# EAGLE design Esquemático (EAGLE 9.6.2)
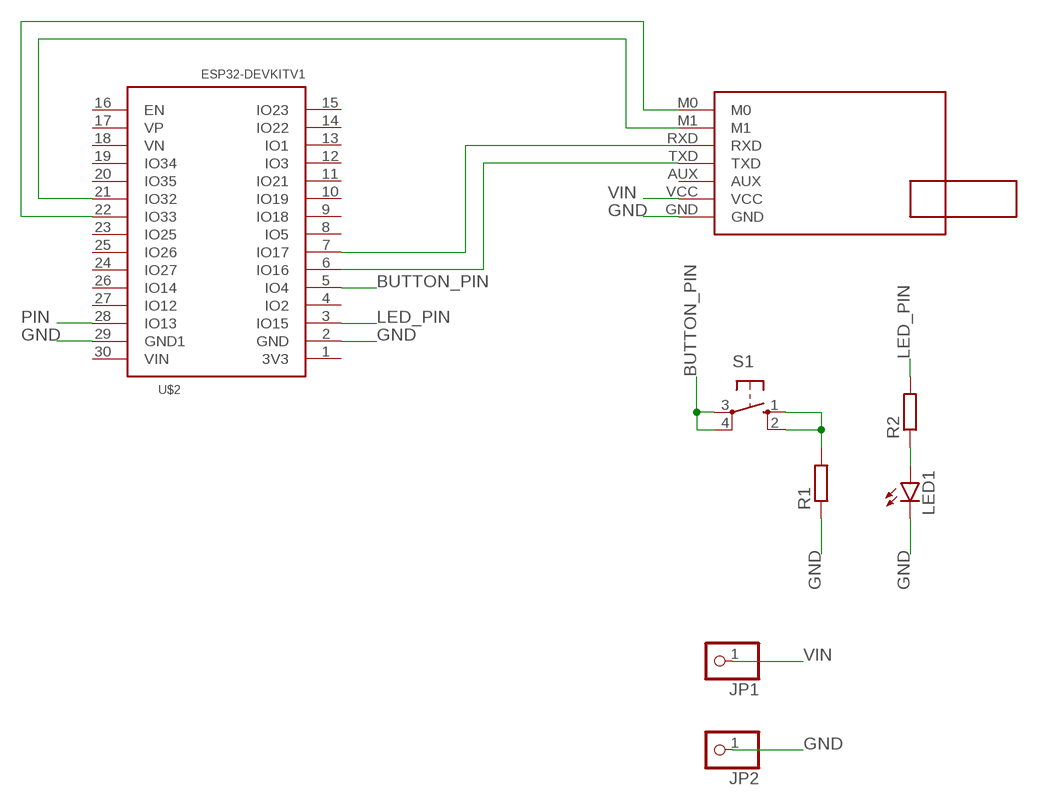
[diagram p0: schematic, sheet 1]

## Parts
JP1  PINHD-1X1  [1X01]
JP2  PINHD-1X1  [1X01]
LED1  LED5MM  [LED5MM]
R1  R-EU_0207/10  [0207/10]
R2  R-EU_0207/10  [0207/10]
S1  10-XX  [B3F-10XX]
U$1  E22-400T30D  [E22-400T30D_FOOTPRINT]
U$2  ESP32DEVKITV1  [ESP32-DEVKITV1]

## Nets
BUTTON_PIN: S1.3(P) S1.4(P1) U$2.5(IO4)
GND: JP2.1 LED1.K(C) R1.1 U$1.GND U$2.2(GND) U$2.29(GND1)
LED_PIN: R2.2 U$2.3(IO15)
N$1: R1.2 S1.1(S) S1.2(S1)
N$2: LED1.A R2.1
N$3: U$1.TXD U$2.6(IO16)
N$4: U$1.RXD U$2.7(IO17)
N$5: U$1.M0 U$2.22(IO33)
N$6: U$1.M1 U$2.21(IO32)
PIN: U$2.28(IO13)
VIN: JP1.1 U$1.VCC
Unconnected: U$1.AUX U$2.1(3V3) U$2.4(IO2) U$2.8(IO5) U$2.9(IO18) U$2.10(IO19) U$2.11(IO21) U$2.12(IO3) U$2.13(IO1) U$2.14(IO22) U$2.15(IO23) U$2.16(EN) U$2.17(VP) U$2.18(VN) U$2.19(IO34) U$2.20(IO35) U$2.23(IO25) U$2.24(IO27) U$2.25(IO26) U$2.26(IO14) U$2.27(IO12) U$2.30(VIN)

## Library data of the parts
JP1 JP2 = pinhead:PINHD-1X1: PIN HEADER
LED1 = led:LED: LED OSRAM: - CHIPLED LG R971, LG N971, LY N971, LG Q971, LY Q971, LO R971, LY R971 LH N974, LH R974 LS Q976, LO Q976, LY Q976 LO Q996 - Hyper CHIPLED LW Q18S LB Q993, LB Q99A, LB R99A - SideLED LS A670, LO A670, LY A670, LG A670, LP A670 LB A673, LV A673, LT A673, LW A673 LH A674 LY A675 LS A676, LA A676, LO A676, LY A676, LW A676 LS A679, LY A679, LG A679 - Hyper Micro SIDELED® LS Y876, LA Y876, LO Y876, LY Y876 LT Y87S - SmartLED LW L88C, LW L88S LB L89C, LB L89S, LG L890 LS L89K, LO L89K, LY L89K LS L896, LA L896, LO L896, LY L896 - TOPLED LS T670, LO T670, LY T670, LG T670, LP T670 LSG T670, LSP T670, LSY T670, LOP T670, LYG T670 LG T671, LOG T671, LSG T671 LB T673, LV T673, LT T673, LW T673 LH T674 LS T676, LA T676, LO T676, LY T676, LB T676, LH T676, LSB T676, LW T676 LB T67C, LV T67C, LT T67C, LS T67K, LO T67K, LY T67K, LW E67C LS E67B, LA E67B, LO E67B, LY E67B, LB E67C, LV E67C, LT E67C LW T67C LS T679, LY T679, LG T679 LS T770, LO T770, LY T770, LG T770, LP T770 LB T773, LV T773, LT T773, LW T773 LH T774 LS E675, LA E675, LY E675, LS T675 LS T776, LA T776, LO T776, LY T776, LB T776 LHGB T686 LT T68C, LB T68C - Hyper Mini TOPLED® LB M676 - Mini TOPLED Santana® LG M470 LS M47K, LO M47K, LY M47K Source: http://www.osram.convergy.de LUXEON: - LUMILED® LXK2-PW12-R00, LXK2-PW12-S00, LXK2-PW14-U00, LXK2-PW14-V00 LXK2-PM12-R00, LXK2-PM12-S00, LXK2-PM14-U00 LXK2-PE12-Q00, LXK2-PE12-R00, LXK2-PE12-S00, LXK2-PE14-T00, LXK2-PE14-U00 LXK2-PB12-K00, LXK2-PB12-L00, LXK2-PB12-M00, LXK2-PB14-N00, LXK2-PB14-P00, LXK2-PB14-Q00 LXK2-PR12-L00, LXK2-PR12-M00, LXK2-PR14-Q00, LXK2-PR14-R00 LXK2-PD12-Q00, LXK2-PD12-R00, LXK2-PD12-S00 LXK2-PH12-R00, LXK2-PH12-S00 LXK2-PL12-P00, LXK2-PL12-Q00, LXK2-PL12-R00 Source: www.luxeon.com KINGBRIGHT: KA-3528ASYC Source: www.kingbright.com
R1 R2 = rcl:R-EU_: RESISTOR, European symbol; SPICEPREFIX: R
S1 = switch-omron:10-XX: OMRON SWITCH; MPN: B3F-1000; OC_FARNELL: 176432; OC_NEWARK: 36M3542
U$1 = CRD:E22-400T30D
U$2 = ESP32-DEVKITV1:ESP32DEVKITV1

## Board
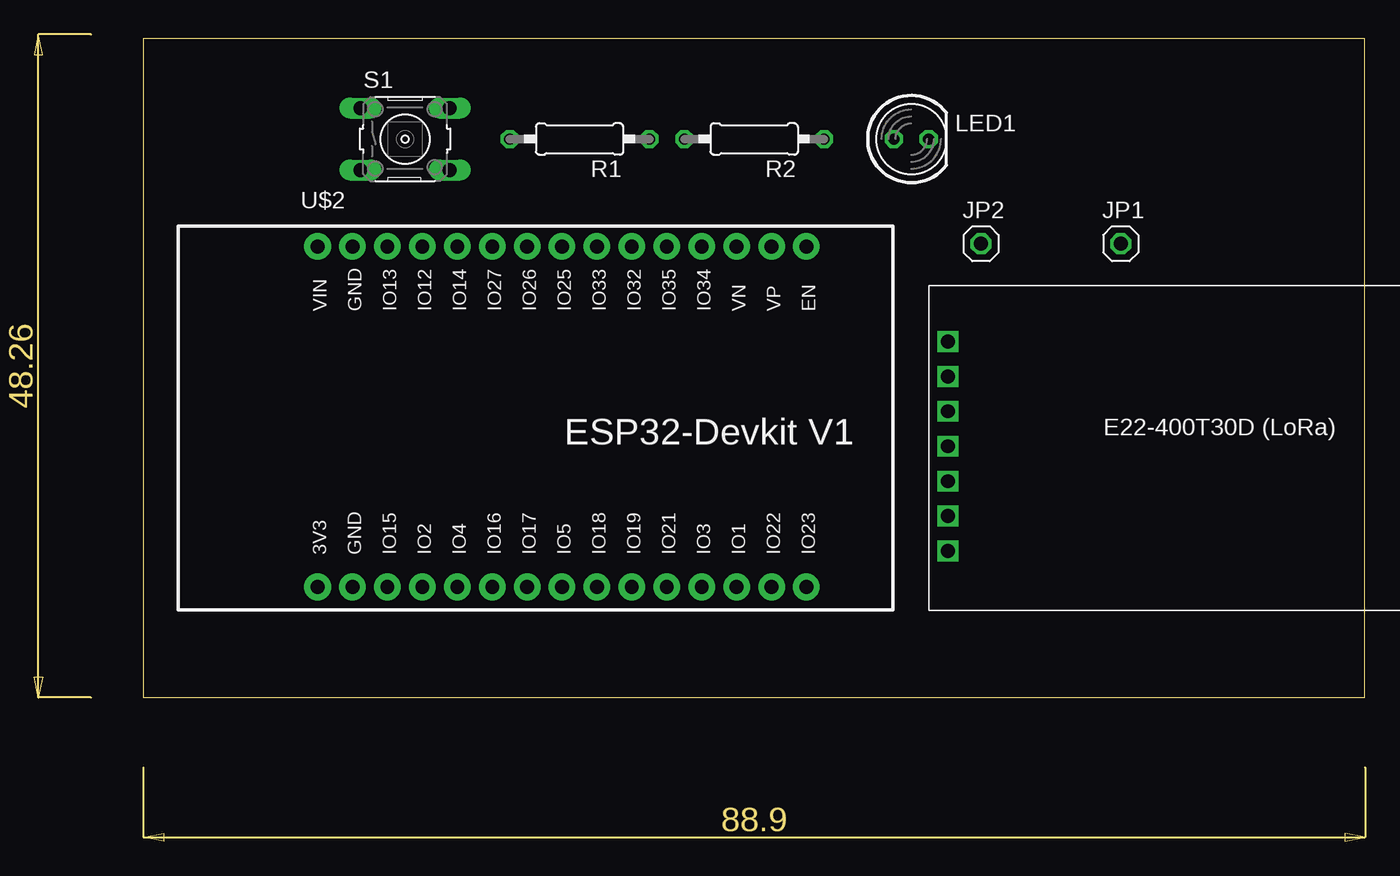
[diagram p1: board, top side]
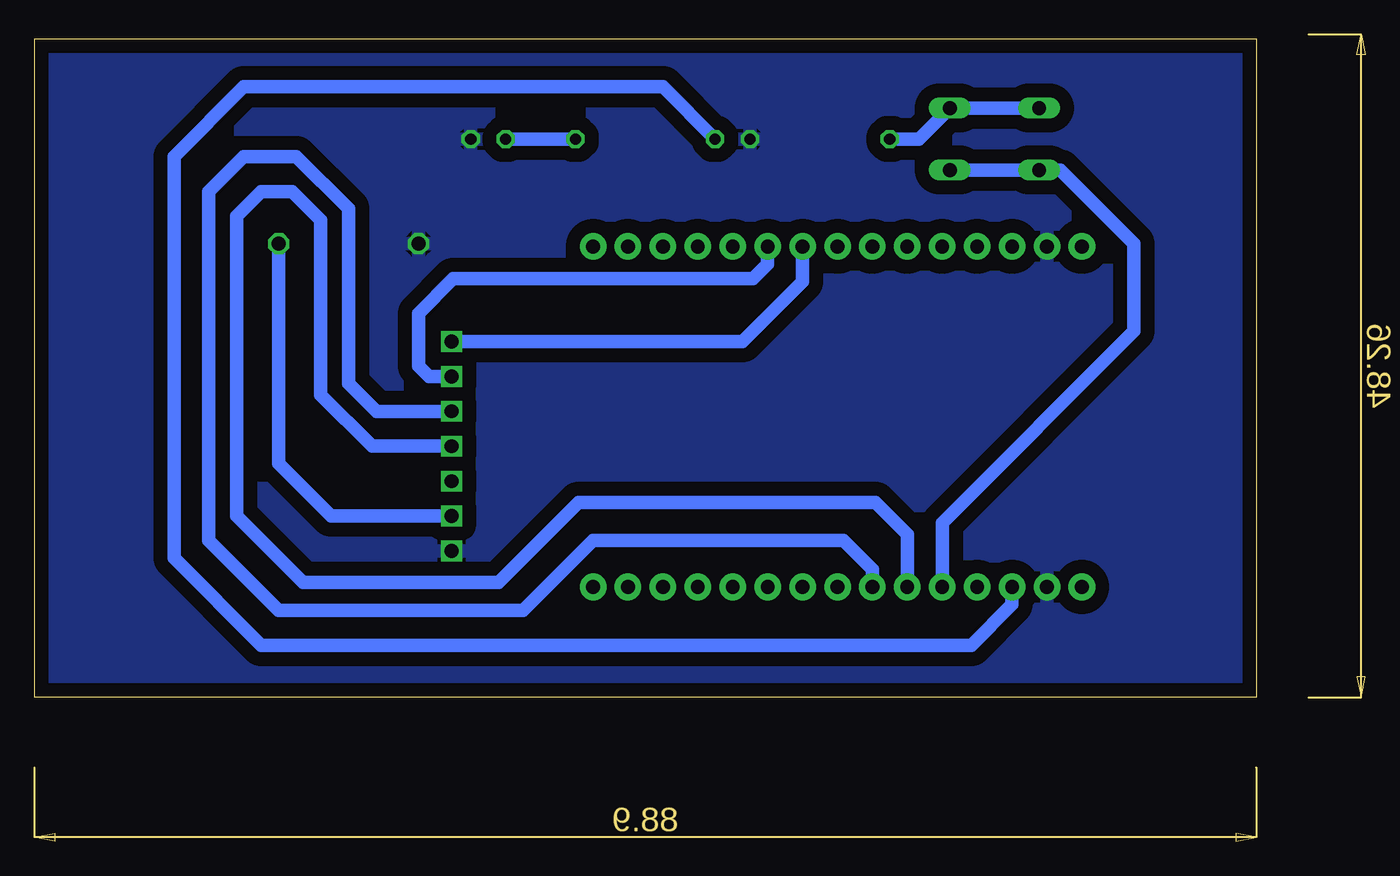
[diagram p2: board, bottom side, seen from below]

Size 88.88 x 47.93 mm. Coordinates in mm from the lower left corner, seen from the top.
Outline: 0,0 88.88,0 88.88,47.93 0,47.93 0,0
Copper layers (1*16): Top 0.035mm / dielectric 1.5mm / Bottom 0.035mm
Design rules "default *": minimum track width 1mm, minimum drill 0.35mm, track to track 40mil, track to pad 0.5mm, pad to pad 6mil, via to via 6mil, smd to smd 6mil, copper to edge 40mil, drill to drill 6mil, minimum pad ring 10mil, minimum via ring 8mil, stop-mask expansion 4mil, vias tented up to drill 0mil, thermal gap 10mil

### Footprints (pad centres in the part's own frame; a part is rotated, then mirrored left to right if it is on the bottom)
1X01 = drill 1.016 octagon: 1 0,0
LED5MM = drill 0.813 octagon: A -1.27,0; K 1.27,0
0207/10 = drill 0.813 octagon: 1 -5.08,0; 2 5.08,0
B3F-10XX = drill 1.016 long: 1 -3.251,2.261; 2 3.251,2.261; 3 -3.251,-2.261; 4 3.251,-2.261
E22-400T30D_FOOTPRINT = drill 1 square: AUX -16.383,-0.762; GND -16.383,-5.842; M0 -16.383,9.398; M1 -16.383,6.858; RXD -16.383,4.318; TXD -16.383,1.778; VCC -16.383,-3.302
ESP32-DEVKITV1 = drill 1 pad 1.93: 1 -22.87,-13.54; 2 -20.33,-13.54; 3 -17.79,-13.54; 4 -15.25,-13.54; 5 -12.71,-13.54; 6 -10.17,-13.54; 7 -7.63,-13.54; 8 -5.09,-13.54; 9 -2.55,-13.54; 10 -0.01,-13.54; 11 2.53,-13.54; 12 5.07,-13.54; 13 7.61,-13.54; 14 10.15,-13.54; 15 12.69,-13.54; 16 12.69,11.23; 17 10.15,11.23; 18 7.61,11.23; 19 5.07,11.23; 20 2.53,11.23; 21 -0.01,11.23; 22 -2.55,11.23; 23 -5.09,11.23; 24 -7.63,11.23; 25 -10.17,11.23; 26 -12.71,11.23; 27 -15.25,11.23; 28 -17.79,11.23; 29 -20.33,11.23; 30 -22.87,11.23

### Placement (x,y rotation side)
JP1  71.12,33.02 0 top
JP2  60.96,33.02 0 top
LED1  55.88,40.64 0 top
R1  31.75,40.64 180 top
R2  44.45,40.64 180 top
S1  19.05,40.64 0 top
U$1  74.93,16.51 0 top
U$2  35.56,21.59 0 top

### Tracks (layer width: path | path; a pad name or v marks a point on that pad's centre or on a via)
BUTTON_PIN
  Bottom 1: U$2.5 22.85,12.71 8.89,26.67 8.89,33.02 14.25,38.38 S1.3 S1.4
GND
  pour Bottom: 1.27,1.27 87.63,1.27 87.63,46.99 1.27,46.99
LED_PIN
  Bottom 1: U$2.3 17.77,6.78 20.74,3.81 72.39,3.81 78.74,10.16 78.74,39.37 73.66,44.45 43.18,44.45 R2.2
N$1
  Bottom 1: R1.2 24.56,40.64 S1.2 S1.1
N$2
  Bottom 1: R2.1 LED1.A
N$3
  Bottom 1: U$2.6 25.39,11.86 27.72,14.19 49.31,14.19 55.12,8.38 69.34,8.38 74.18,13.22 74.18,35.04 72.39,36.83 70.16,36.83 68.06,34.72 68.06,22.03 64.32,18.29 U$1.TXD
N$4
  Bottom 1: U$2.7 27.93,9.32 30.04,11.43 48.26,11.43 53.34,6.35 71.12,6.35 76.2,11.43 76.2,36.83 73.66,39.37 69.85,39.37 66.04,35.56 66.04,22.86 64.01,20.83 U$1.RXD
N$5
  Bottom 1: U$2.22 33.01,30.28 37.38,25.91 U$1.M0
N$6
  Bottom 1: U$2.21 35.55,31.55 36.62,30.48 58.42,30.48 60.96,27.94 60.96,24.13 60.2,23.37 U$1.M1
VIN
  Bottom 1: U$1.VCC 67.31,13.21 71.12,17.02 JP1.1